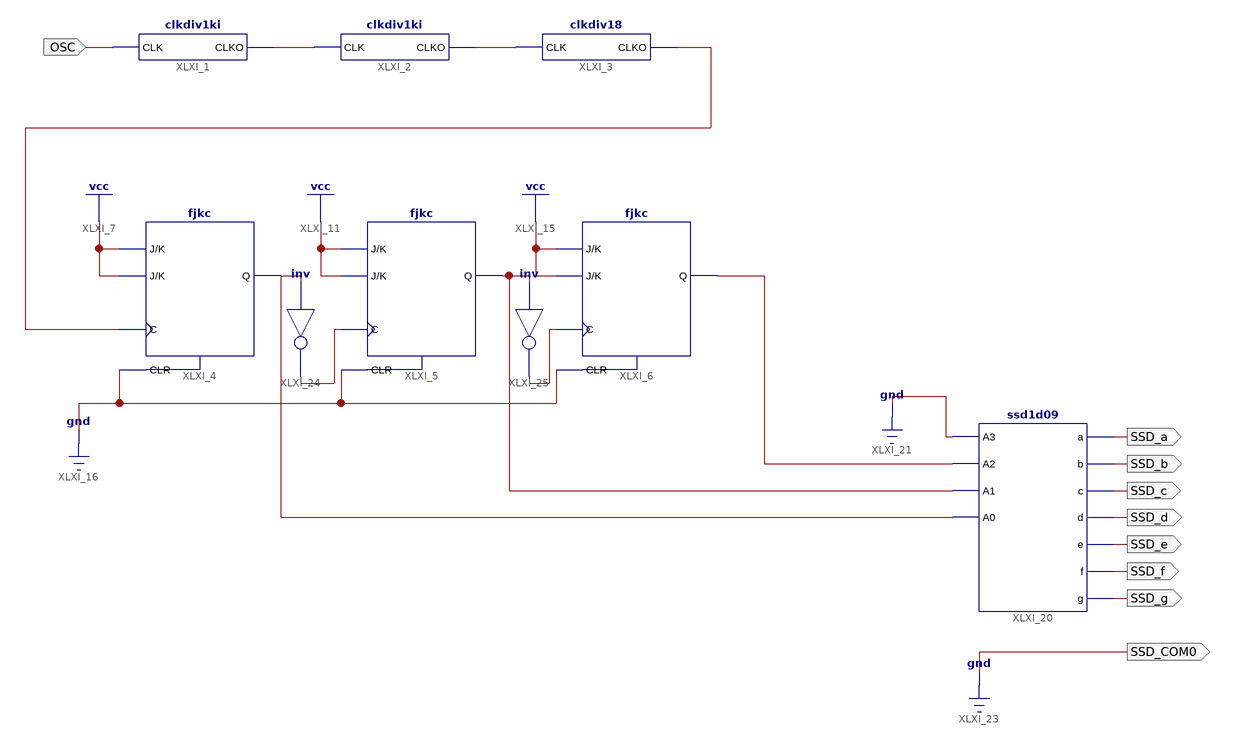
[diagram p0: schematic sheet 1]
// Xilinx ISE schematic integration.sch (spartan6) as structural Verilog: 9 symbols, 9 ports
module integration (
  input  OSC,
  output SSD_a,
  output SSD_b,
  output SSD_c,
  output SSD_d,
  output SSD_e,
  output SSD_f,
  output SSD_g,
  output SSD_COM0
);

  wire XLXN_1, XLXN_2, XLXN_6, XLXN_7, XLXN_24, XLXN_35, XLXN_36, XLXN_43;

  clkdiv1ki XLXI_1 (.CLK(OSC), .CLKO(XLXN_1));
  clkdiv1ki XLXI_2 (.CLK(XLXN_1), .CLKO(XLXN_2));
  clkdiv18 XLXI_3 (.CLK(XLXN_2), .CLKO(XLXN_7));
  fjkc XLXI_4 (.C(XLXN_7), .CLR(1'b0), .J(1'b1), .K(1'b1), .Q(XLXN_35));
  fjkc XLXI_5 (.C(XLXN_36), .CLR(1'b0), .J(1'b1), .K(1'b1), .Q(XLXN_6));
  fjkc XLXI_6 (.C(XLXN_43), .CLR(1'b0), .J(1'b1), .K(1'b1), .Q(XLXN_24));
  ssd1d09 XLXI_20 (
    .a(SSD_a), .A0(XLXN_35), .A1(XLXN_6), .A2(XLXN_24), .A3(1'b0), .b(SSD_b), .c(SSD_c), .d(SSD_d),
    .e(SSD_e), .f(SSD_f), .g(SSD_g));
  not XLXI_24 (XLXN_36, XLXN_35);
  not XLXI_25 (XLXN_43, XLXN_6);

  assign SSD_COM0 = 1'b0;
endmodule
